# EAGLE design base_revA (EAGLE 7.3.0)
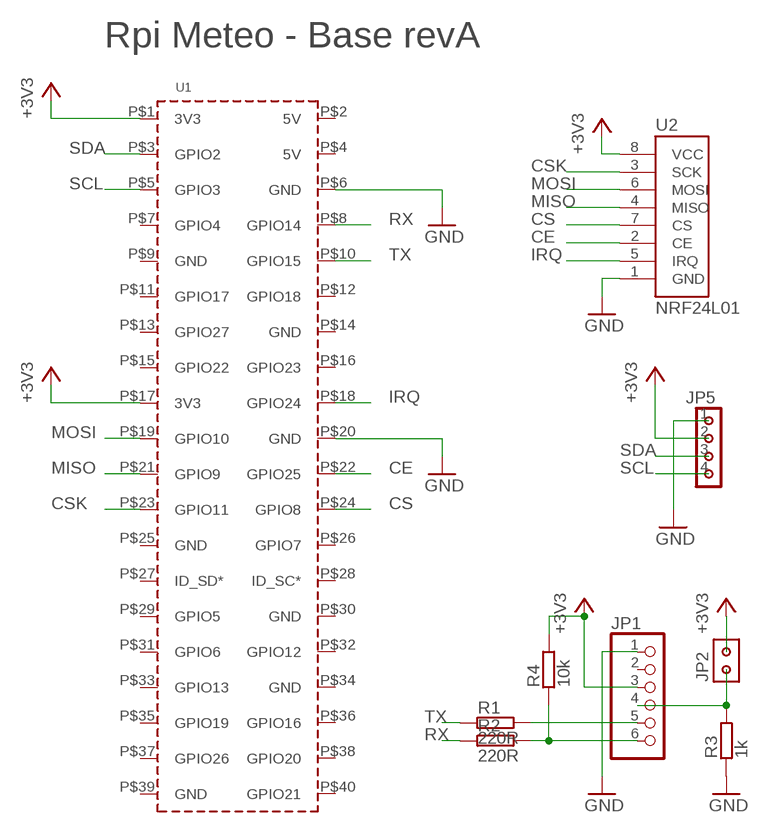
[diagram p0: schematic, sheet 1]

## Parts
JP1  PINHD-1X6  [1X06]
JP2  PINHD-2X1  [PINHD-2X1]
JP5  PINHD-4X1'BASIC'  [1X04]
R1  220R  R-0207/10  [0207-10]
R2  220R  R-0207/10  [0207-10]
R3  1k  R-0207/10  [0207-10]
R4  10k  R-0207/10  [0207-10]
U1  RPI3_SIMPLE'FULL'  [RPI3]
U2  NRF24L01  [NRF24L01]

## Nets
+3V3: JP1.3 JP2.1 JP5.2 R4.2 U1.P$1(3V3) U1.P$17(3V3) U2.8(VCC)
CE: U1.P$22(GPIO25) U2.2(CE)
CS: U1.P$24(GPIO8) U2.7(CS)
CSK: U1.P$23(GPIO11) U2.3(SCK)
GND: JP1.1 JP5.1 R3.1 U1.P$6(GND) U1.P$20(GND) U2.1(GND)
IRQ: U1.P$18(GPIO24) U2.5(IRQ)
MISO: U1.P$21(GPIO9) U2.4(MISO)
MOSI: U1.P$19(GPIO10) U2.6(MOSI)
N$1: JP1.4 JP2.2 R3.2
N$2: JP1.6 R2.2 R4.1
N$3: JP1.5 R1.2
RX: R2.1 U1.P$8(GPIO14)
SCL: JP5.4 U1.P$5(GPIO3)
SDA: JP5.3 U1.P$3(GPIO2)
TX: R1.1 U1.P$10(GPIO15)
Unconnected: JP1.2 U1.P$2(5V) U1.P$4(5V) U1.P$7(GPIO4) U1.P$9(GND) U1.P$11(GPIO17) U1.P$12(GPIO18) U1.P$13(GPIO27) U1.P$14(GND) U1.P$15(GPIO22) U1.P$16(GPIO23) U1.P$25(GND) U1.P$26(GPIO7) U1.P$27(ID_SD*) U1.P$28(ID_SC*) U1.P$29(GPIO5) U1.P$30(GND) U1.P$31(GPIO6) U1.P$32(GPIO12) U1.P$33(GPIO13) U1.P$34(GND) U1.P$35(GPIO19) U1.P$36(GPIO16) U1.P$37(GPIO26) U1.P$38(GPIO20) U1.P$39(GND) U1.P$40(GPIO21)

## Notes on the sheet
- Rpi Meteo - Base revA

## Library data of the parts
JP1 = 1_domaci:PINHD-1X6: PIN HEADER
JP2 = 1_domaci:PINHD-2X1
JP5 = 1_domaci:PINHD-4X1: PIN HEADER
R1-R4 = 1_domaci:R-0207/10
U1 = 1_domaci:RPI3_SIMPLE: Device for Raspberry Pi 3 board created by Dave Young for www.element14.com More information and support community is available at https://www.element14.com/community/community/raspberry-pi
U2 = 1_domaci:NRF24L01

## Board
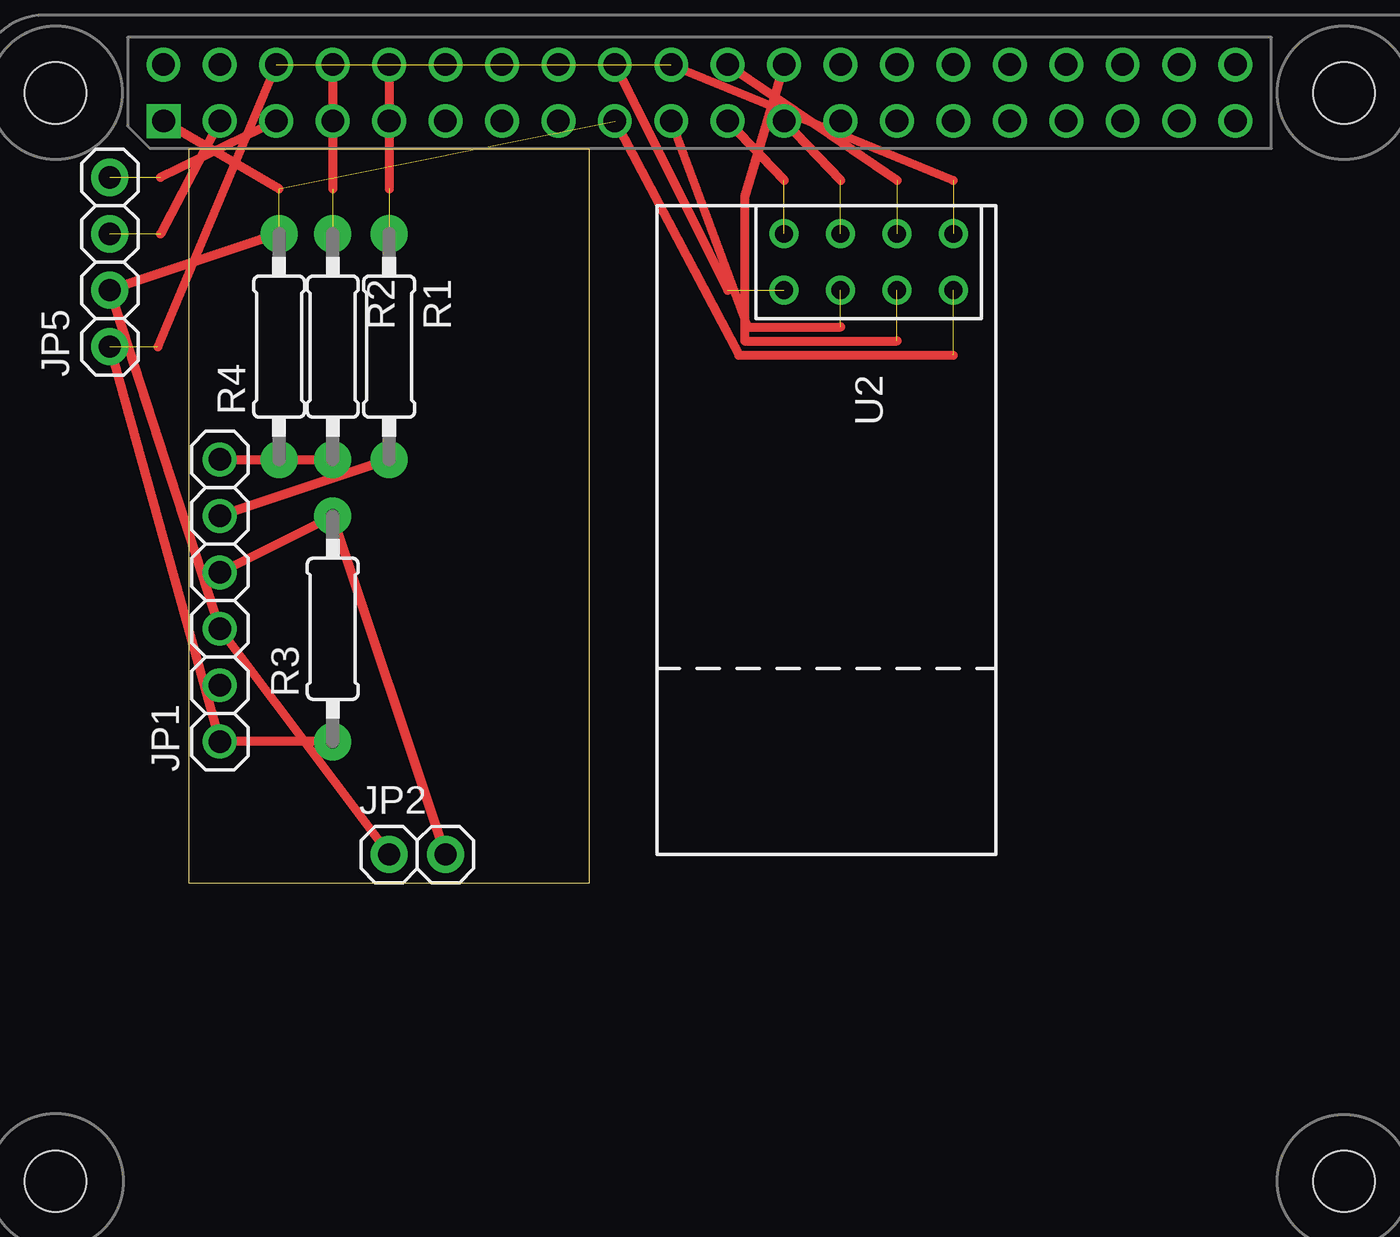
[diagram p1: board, top side]

Size 18.03 x 33.02 mm. Coordinates in mm from the lower left corner, seen from the top.
Copper layers (1*16): Top 0.035mm / dielectric 1.5mm / Bottom 0.035mm
Design rules "default": minimum track width 10mil, minimum drill 24mil, track to track 8mil, track to pad 8mil, pad to pad 8mil, via to via 8mil, smd to smd 8mil, copper to edge 40mil, drill to drill 8mil, minimum pad ring 10mil, minimum via ring 8mil, stop-mask expansion 4mil, vias tented up to drill 0mil, thermal gap 10mil

### Footprints (pad centres in the part's own frame; a part is rotated, then mirrored left to right if it is on the bottom)
1X06 = drill 1.016: 1 -6.35,0; 2 -3.81,0; 3 -1.27,0; 4 1.27,0; 5 3.81,0; 6 6.35,0
PINHD-2X1 = drill 1 pad 1.676: 1 -1.27,0; 2 1.27,0
1X04 = drill 1 pad 1.676: 1 -3.81,0; 2 -1.27,0; 3 1.27,0; 4 3.81,0
0207-10 = drill 0.6 pad 1.676: 1 -5.08,0; 2 5.08,0
RPI3 = drill 1.016 square: P$1 8.522,51.306 | drill 1.016: P$2 8.509,53.848; P$3 11.049,51.308; P$4 11.049,53.848; P$5 13.589,51.308; P$6 13.589,53.848; P$7 16.129,51.308; P$8 16.129,53.848; P$9 18.669,51.308; P$10 18.669,53.848; P$11 21.209,51.308; P$12 21.209,53.848; P$13 23.749,51.308; P$14 23.749,53.848; P$15 26.289,51.308; P$16 26.289,53.848; P$17 28.829,51.308; P$18 28.829,53.848; P$19 31.369,51.308; P$20 31.369,53.848; P$21 33.909,51.308; P$22 33.909,53.848; P$23 36.449,51.308; P$24 36.449,53.848; P$25 38.989,51.308; P$26 38.989,53.848; P$27 41.529,51.308; P$28 41.529,53.848; P$29 44.069,51.308; P$30 44.069,53.848; P$31 46.609,51.308; P$32 46.609,53.848; P$33 49.149,51.308; P$34 49.149,53.848; P$35 51.689,51.308; P$36 51.689,53.848; P$37 54.229,51.308; P$38 54.229,53.848; P$39 56.769,51.308; P$40 56.769,53.848 | hole 2.75: 3.652,3.576; 61.652,3.576; 3.652,52.576; 61.652,52.576
NRF24L01 = drill 0.8: 1 -1.27,5.08; 2 -1.27,2.54; 3 -1.27,0; 4 -1.27,-2.54; 5 1.27,-2.54; 6 1.27,0; 7 1.27,2.54; 8 1.27,5.08

### Placement (x,y rotation side)
JP1  1.4,12.7 90 top
JP2  10.29,1.27 0 top
JP5  -3.56,27.94 90 top  (outside the outline)
R1  9.02,24.13 270 top
R2  6.48,24.13 270 top
R3  6.48,11.43 90 top
R4  4.06,24.13 90 top
U1  -9.65,-17.02 0 top
U2  29.34,27.94 270 top  (outside the outline)

### Tracks (layer width: path | path; a pad name or v marks a point on that pad's centre or on a via)
+3V3  (3 unrouted)
  Top 0.406: U1.P$17 24.76,23.75 34.42,23.75 | U1.P$1 4.06,31.24 | R4.2 JP5.2 JP1.3 JP2.1
CE  (1 unrouted)
  Top 0.406: U1.P$22 31.88,31.62
CS  (1 unrouted)
  Top 0.406: U1.P$24 25.02,30.86 25.02,24.38 31.88,24.38
CSK  (1 unrouted)
  Top 0.406: U1.P$23 29.34,31.62
GND  (3 unrouted)
  Top 0.406: U1.P$20 34.42,31.62 | R3.1 JP1.1 JP5.1 | U1.P$6 -1.4,24.13
IRQ  (1 unrouted)
  Top 0.406: U1.P$18 24.26,26.67
MISO  (1 unrouted)
  Top 0.406: U1.P$21 26.8,31.62
MOSI  (1 unrouted)
  Top 0.406: U1.P$19 25.15,25.02 29.34,25.02
N$1
  Top 0.406: JP1.4 R3.2 JP2.2
N$2
  Top 0.406: JP1.6 R4.1 R2.2
N$3
  Top 0.406: R1.2 JP1.5
RX  (1 unrouted)
  Top 0.406: U1.P$8 6.48,31.24
SCL  (1 unrouted)
  Top 0.406: U1.P$5 -1.27,31.75
SDA  (1 unrouted)
  Top 0.406: U1.P$3 -1.27,29.21
TX  (1 unrouted)
  Top 0.406: U1.P$10 9.02,31.24